# EAGLE schematic Arduino Environmental Monitor (EAGLE 7.5.0)
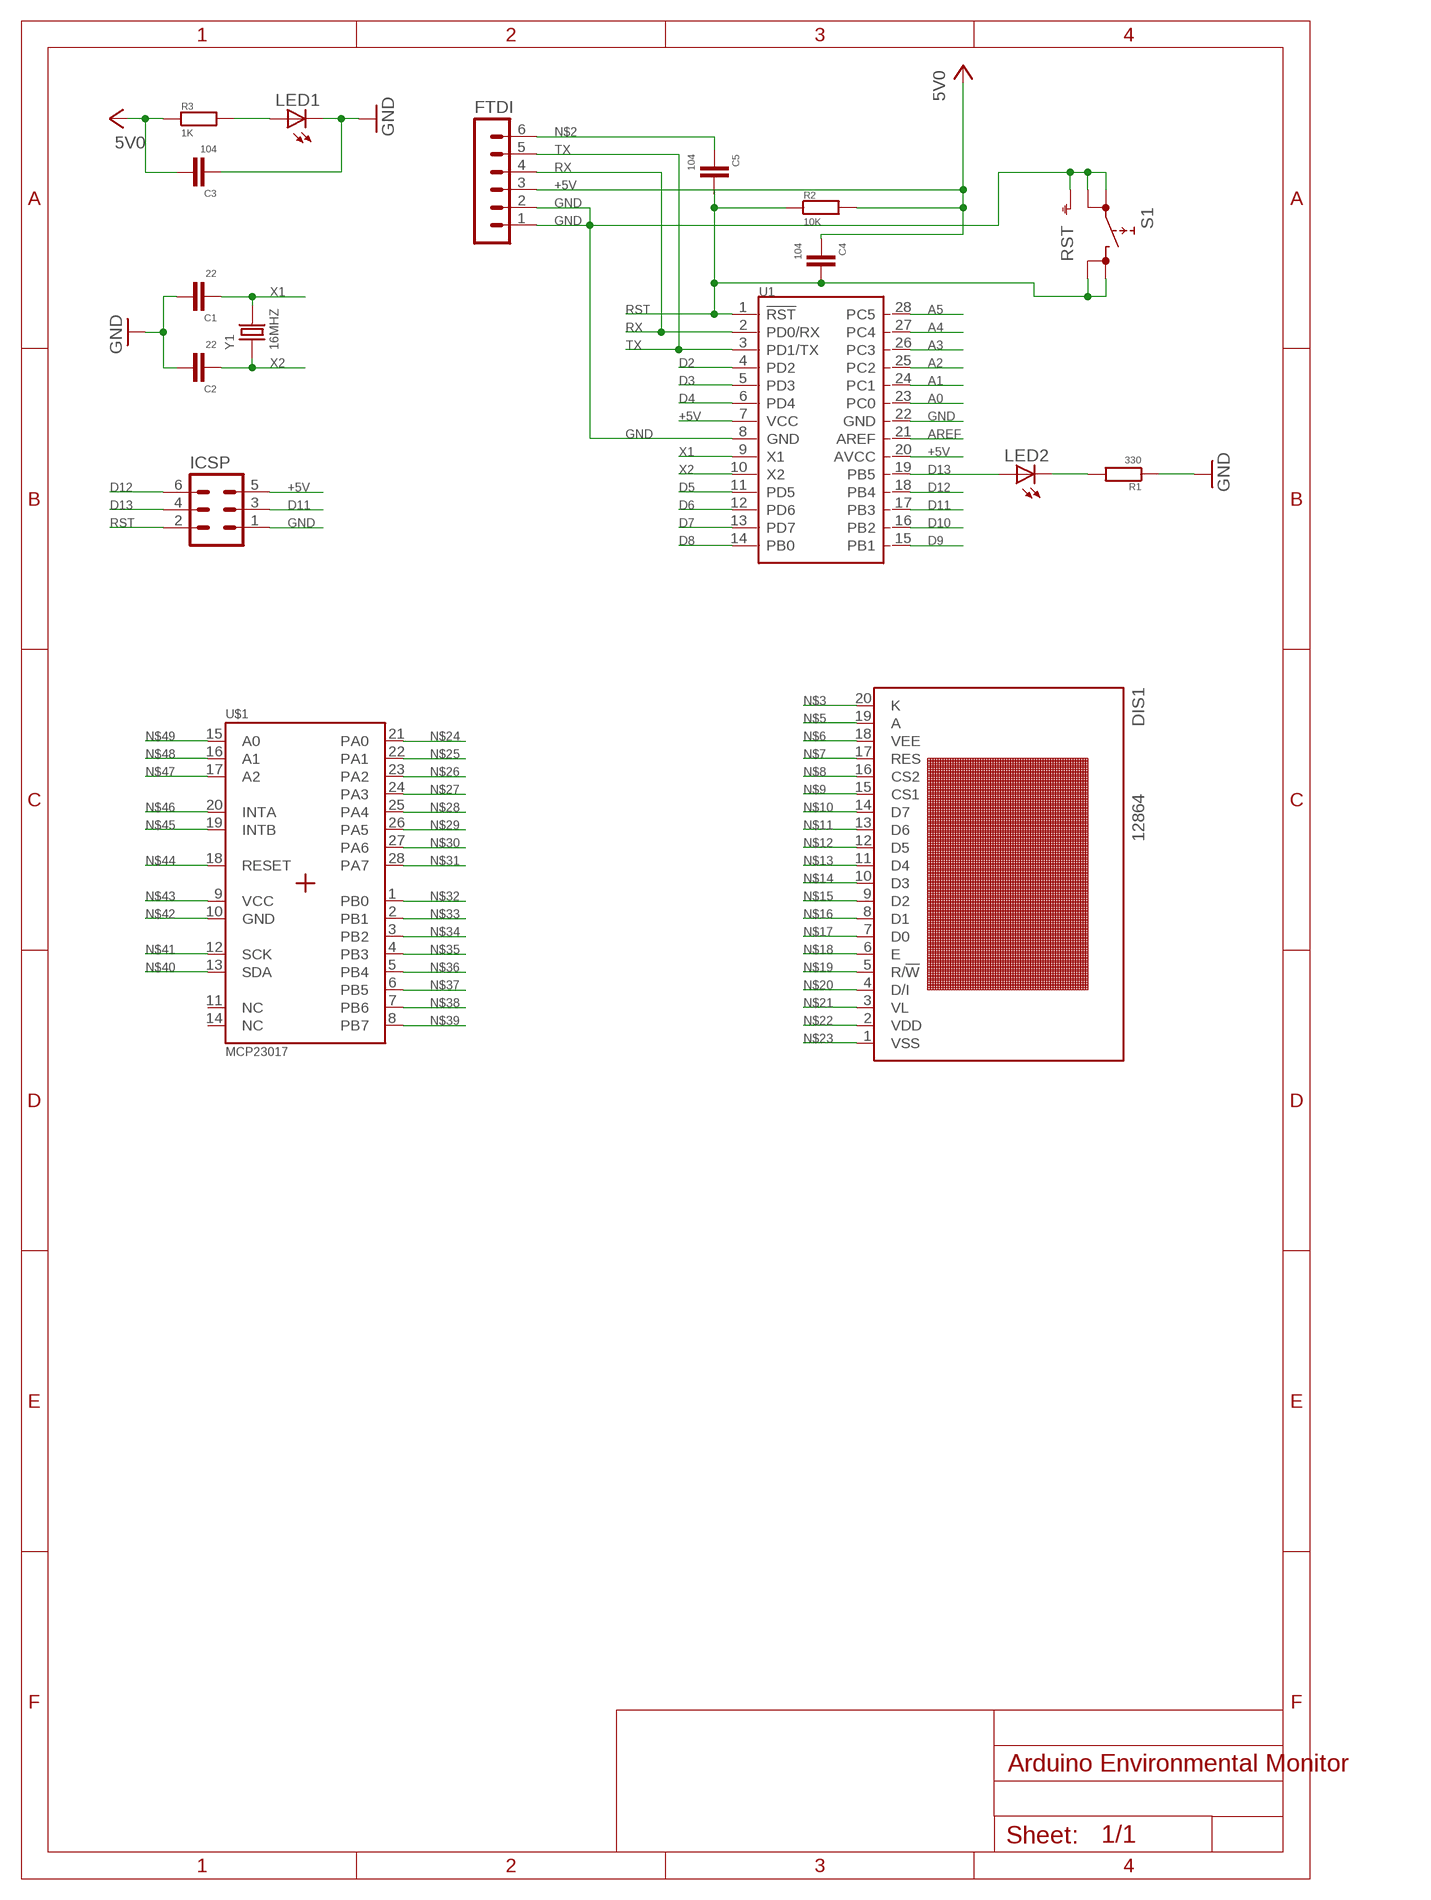
[diagram p0: schematic, sheet 1]

## Parts
C1  22  CC0805  [C0805]
C2  22  CC0805  [C0805]
C3  104  CC0805  [C0805]
C4  104  CC0805  [C0805]
C5  104  CC0805  [C0805]
DIS1  12864  LCD128X64  [LCD128X64]
FTDI  MA06-1  [MA06-1]
ICSP  MA03-2  [MA03-2]
LED1  LEDCHIPLED_0805  [CHIPLED_0805]
LED2  LEDCHIPLED_0805  [CHIPLED_0805]
R1  330  RR0805  [R0805]
R2  10K  RR0805  [R0805]
R3  1K  RR0805  [R0805]
S1  RST  SKHMPSE010  [SKHMPXE010]
U1  MCU-ATMEGA328P-PU(DIP28)  [DIP28-2.54-35.6X13.5MM]
U$1  MCP23017  [SO28W]
Y1  16MHZ  DIP-CRYSTAL-16MHZ-18PF-30PPM-40R(HC49US)  [HC49US]

## Nets
+5V: C3.1 C4.2 FTDI.3 ICSP.5 R2.2 R3.1 U1.7(VCC) U1.20(AVCC) ; supply symbol labelled 5V0
A0: U1.23(PC0)
A1: U1.24(PC1)
A2: U1.25(PC2)
A3: U1.26(PC3)
A4: U1.27(PC4)
A5: U1.28(PC5)
AREF: U1.21(AREF)
D2: U1.4(PD2)
D3: U1.5(PD3)
D4: U1.6(PD4)
D5: U1.11(PD5)
D6: U1.12(PD6)
D7: U1.13(PD7)
D8: U1.14(PB0)
D9: U1.15(PB1)
D10: U1.16(PB2)
D11: ICSP.3 U1.17(PB3)
D12: ICSP.6 U1.18(PB4)
D13: ICSP.4 LED2.A U1.19(PB5)
GND: C1.1 C2.1 C3.2 FTDI.1 FTDI.2 ICSP.1 LED1.C R1.1 S1.1(1.1) S1.2(1.2) S1.5(SH) U1.8(GND) U1.22(GND)
N$1: LED1.A R3.2
N$2: C5.2 FTDI.6
N$3: DIS1.20(K)
N$4: LED2.C R1.2
N$5: DIS1.19(A)
N$6: DIS1.18(VEE)
N$7: DIS1.17(RES)
N$8: DIS1.16(CS2)
N$9: DIS1.15(CS1)
N$10: DIS1.14(D7)
N$11: DIS1.13(D6)
N$12: DIS1.12(D5)
N$13: DIS1.11(D4)
N$14: DIS1.10(D3)
N$15: DIS1.9(D2)
N$16: DIS1.8(D1)
N$17: DIS1.7(D0)
N$18: DIS1.6(E)
N$19: DIS1.5(R/!W)
N$20: DIS1.4(D/I)
N$21: DIS1.3(VL)
N$22: DIS1.2(VDD)
N$23: DIS1.1(VSS)
N$24: U$1.21(PA0)
N$25: U$1.22(PA1)
N$26: U$1.23(PA2)
N$27: U$1.24(PA3)
N$28: U$1.25(PA4)
N$29: U$1.26(PA5)
N$30: U$1.27(PA6)
N$31: U$1.28(PA7)
N$32: U$1.1(PB0)
N$33: U$1.2(PB1)
N$34: U$1.3(PB2)
N$35: U$1.4(PB3)
N$36: U$1.5(PB4)
N$37: U$1.6(PB5)
N$38: U$1.7(PB6)
N$39: U$1.8(PB7)
N$40: U$1.13(SDA)
N$41: U$1.12(SCK)
N$42: U$1.10(GND)
N$43: U$1.9(VCC)
N$44: U$1.18(RESET)
N$45: U$1.19(INTB)
N$46: U$1.20(INTA)
N$47: U$1.17(A2)
N$48: U$1.16(A1)
N$49: U$1.15(A0)
RST: C4.1 ICSP.2 R2.1 S1.3(2.1) S1.4(2.2) U1.1(!RST)
RX: FTDI.4 U1.2(PD0/RX)
TX: FTDI.5 U1.3(PD1/TX)
X1: C1.2 U1.9(X1) Y1.2
X2: C2.2 U1.10(X2) Y1.1
Unconnected: C5.1 U$1.11(NC) U$1.14(NC)

## Library data of the parts
C1-C5 = RCLDA:C: CAPACITOR
DIS1 = Display:LCD128X64: LCD display 128 X 64; OC_FARNELL: unknown; OC_NEWARK: unknown
FTDI = Pin-Header:MA06-1: PIN HEADER; OC_FARNELL: unknown; OC_NEWARK: unknown
ICSP = Pin-Header:MA03-2: PIN HEADER; OC_FARNELL: unknown; OC_NEWARK: unknown
LED1 LED2 = Display:LED: LED OSRAM: - CHIPLED LG R971, LG N971, LY N971, LG Q971, LY Q971, LO R971, LY R971 LH N974, LH R974 LS Q976, LO Q976, LY Q976 LO Q996 - Hyper CHIPLED LW Q18S LB Q993, LB Q99A, LB R99A - SideLED LS A670, LO A670, LY A670, LG A670, LP A670 LB A673, LV A673, LT A673, LW A673 LH A674 LY A675 LS A676, LA A676, LO A676, LY A676, LW A676 LS A679, LY A679, LG A679 - Hyper Micro SIDELED® LS Y876, LA Y876, LO Y876, LY Y876 LT Y87S - SmartLED LW L88C, LW L88S LB L89C, LB L89S, LG L890 LS L89K, LO L89K, LY L89K LS L896, LA L896, LO L896, LY L896 - TOPLED LS T670, LO T670, LY T670, LG T670, LP T670 LSG T670, LSP T670, LSY T670, LOP T670, LYG T670 LG T671, LOG T671, LSG T671 LB T673, LV T673, LT T673, LW T673 LH T674 LS T676, LA T676, LO T676, LY T676, LB T676, LH T676, LSB T676, LW T676 LB T67C, LV T67C, LT T67C, LS T67K, LO T67K, LY T67K, LW E67C LS E67B, LA E67B, LO E67B, LY E67B, LB E67C, LV E67C, LT E67C LW T67C LS T679, LY T679, LG T679 LS T770, LO T770, LY T770, LG T770, LP T770 LB T773, LV T773, LT T773, LW T773 LH T774 LS E675, LA E675, LY E675, LS T675 LS T776, LA T776, LO T776, LY T776, LB T776 LHGB T686 LT T68C, LB T68C - Hyper Mini TOPLED® LB M676 - Mini TOPLED Santana® LG M470 LS M47K, LO M47K, LY M47K Source: http://www.osram.convergy.de LUXEON: - LUMILED® LXK2-PW12-R00, LXK2-PW12-S00, LXK2-PW14-U00, LXK2-PW14-V00 LXK2-PM12-R00, LXK2-PM12-S00, LXK2-PM14-U00 LXK2-PE12-Q00, LXK2-PE12-R00, LXK2-PE12-S00, LXK2-PE14-T00, LXK2-PE14-U00 LXK2-PB12-K00, LXK2-PB12-L00, LXK2-PB12-M00, LXK2-PB14-N00, LXK2-PB14-P00, LXK2-PB14-Q00 LXK2-PR12-L00, LXK2-PR12-M00, LXK2-PR14-Q00, LXK2-PR14-R00 LXK2-PD12-Q00, LXK2-PD12-R00, LXK2-PD12-S00 LXK2-PH12-R00, LXK2-PH12-S00 LXK2-PL12-P00, LXK2-PL12-Q00, LXK2-PL12-R00 Source: www.luxeon.com KINGBRIGHT: KA-3528ASYC Source: www.kingbright.com
R1-R3 = RCLDA:R: RESISTOR
S1 = Button:SKHMP*E010: 6.2 X 6.5mm TACT Switch (SMD) Source: http://www3.alps.co.jp/WebObjects/catalog.woa/PDF/E/Switch/Tact/SKHM/SKHM.PDF
U1 = Chip:MCU-ATMEGA328P-PU(DIP28): 310010051; MPN: ATMEGA328P-PU; VALUE-DIP28: ATMEGA328P-PU
U$1 = Chip:MCP23017
Y1 = Crystal:DIP-CRYSTAL-16MHZ-18PF-30PPM-40R(HC49US): 306010014; MPN: HC-49US 16.000MHz